# EAGLE design uv-dosimeter-guva-op-amp-mk-1.0 (EAGLE 7.5.0)
AUTHOR: sean@yak.net
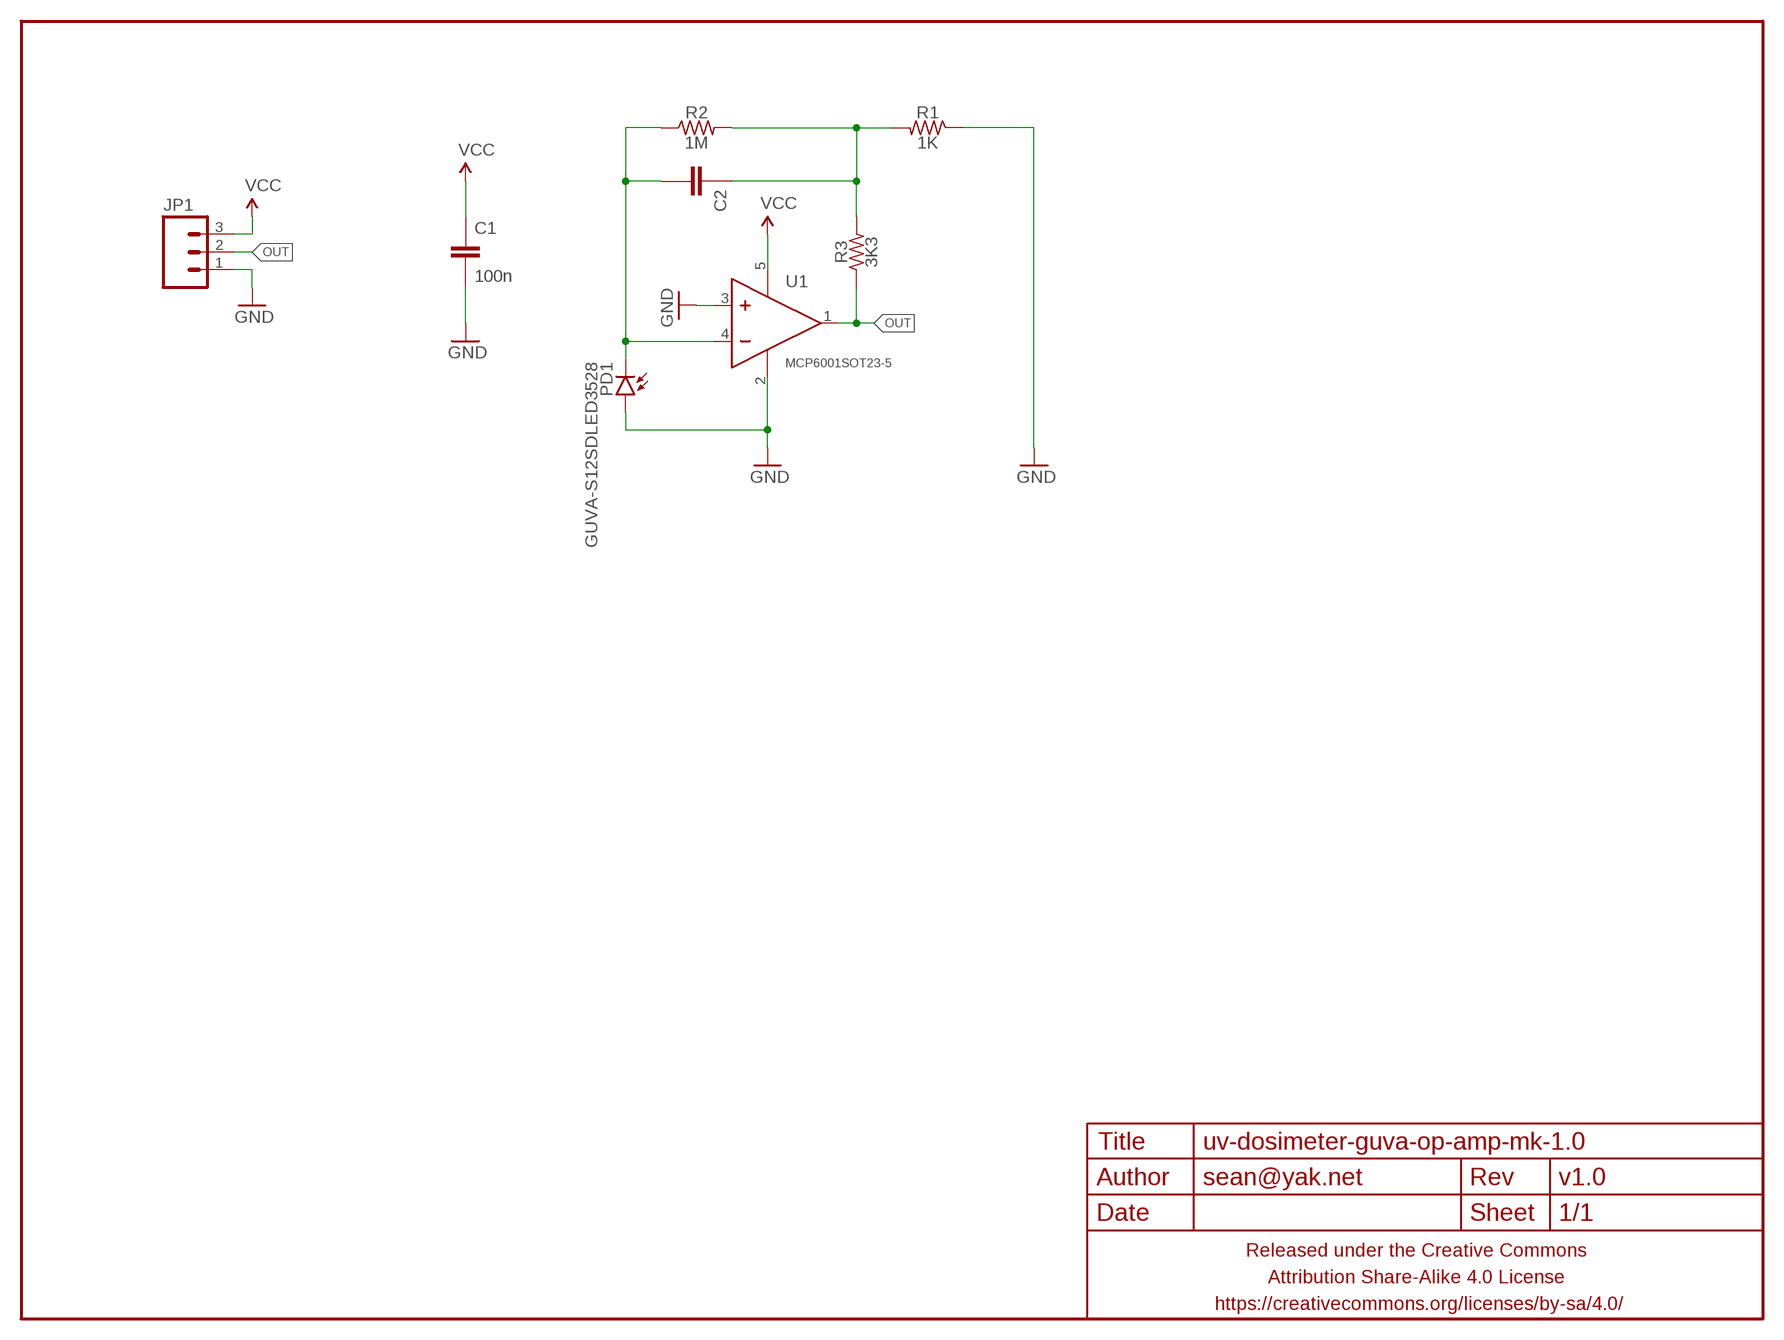
[diagram p0: schematic, sheet 1]

## Parts
C1  100n  CAPACITOR-CERAMICC0603  [C0603]
C2  CAPACITOR-CERAMICC0603  [C0603]
FRAME1  FRAME-LETTERNO_PACKAGE  [DUMMY]
JP1  M03PTH-CENTERED  [1X03-CENTERED]
PD1  GUVA-S12SDLED3528  [LED3528]
R1  1K  RESISTORR0603  [R0603]
R2  1M  RESISTORR0603  [R0603]
R3  3K3  RESISTORR0603  [R0603]
U1  MCP6001SOT23-5  [SOT23-5]

## Nets
GND: C1.2 JP1.1 PD1.A R1.1 U1.2(V-) U1.3(IN+)
N$2: C2.1 R1.2 R2.2 R3.2
N$3: C2.2 PD1.K(C) R2.1 U1.4(IN-)
OUT: JP1.2 R3.1 U1.1(OUT)
VCC: C1.1 JP1.3 U1.5(V+)

## Library data of the parts
C1 C2 = a_parts:CAPACITOR-CERAMIC: CAPACITOR, European symbol
FRAME1 = A_butts:FRAME-LETTER: Schematic Frame Standard 8.5x11 US Letter frame; DESIGNER: sean@yak.net; VERSION: v1.0
JP1 = a_parts:M03: Header 3 Standard 3-pin 0.1" header. Use with straight break away headers (SKU : PRT-00116), right angle break away headers (PRT-00553), swiss pins (PRT-00743), machine pins (PRT-00117), and female headers (PRT-00115). Molex polarized connector foot print use with SKU : PRT-08232 with associated crimp pins and housings.
PD1 = a_parts:GUVA-S12SD
R1-R3 = a_parts:RESISTOR: RESISTOR, American symbol
U1 = a_parts:MCP6001

## Board
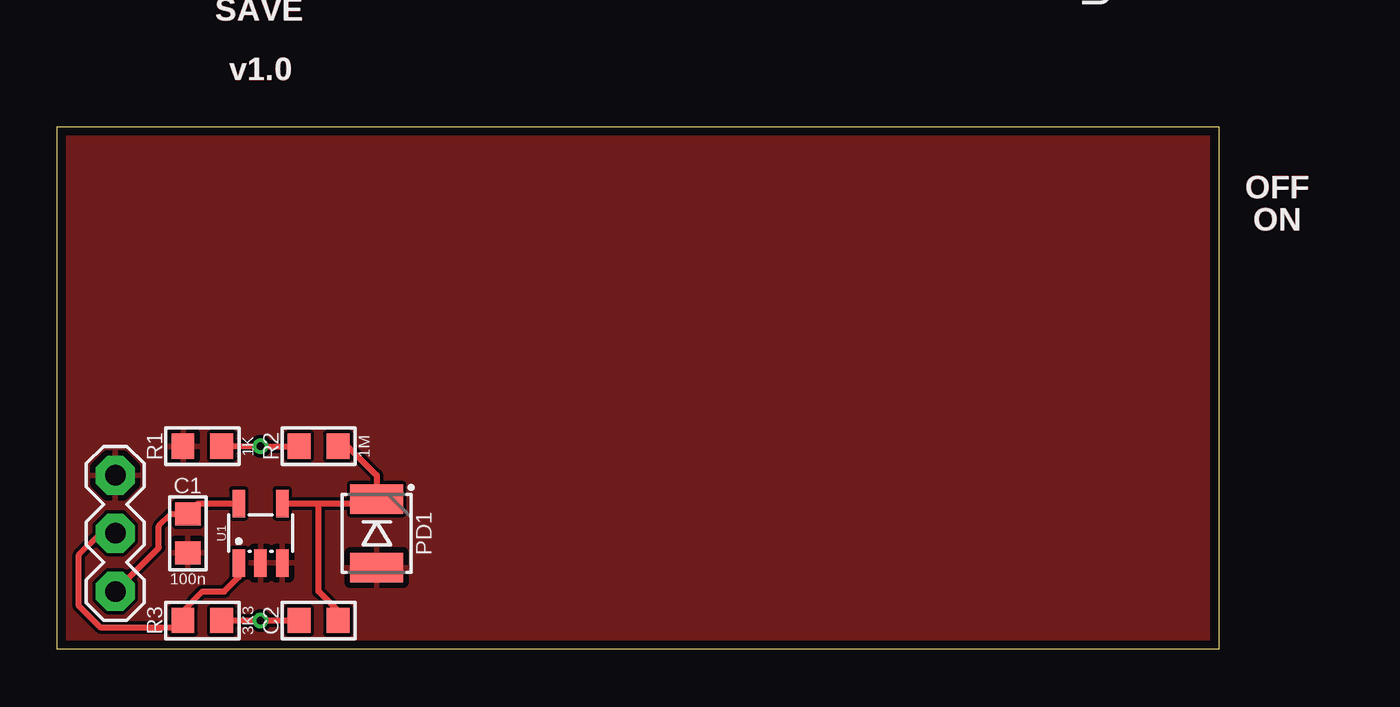
[diagram p1: board, top side]
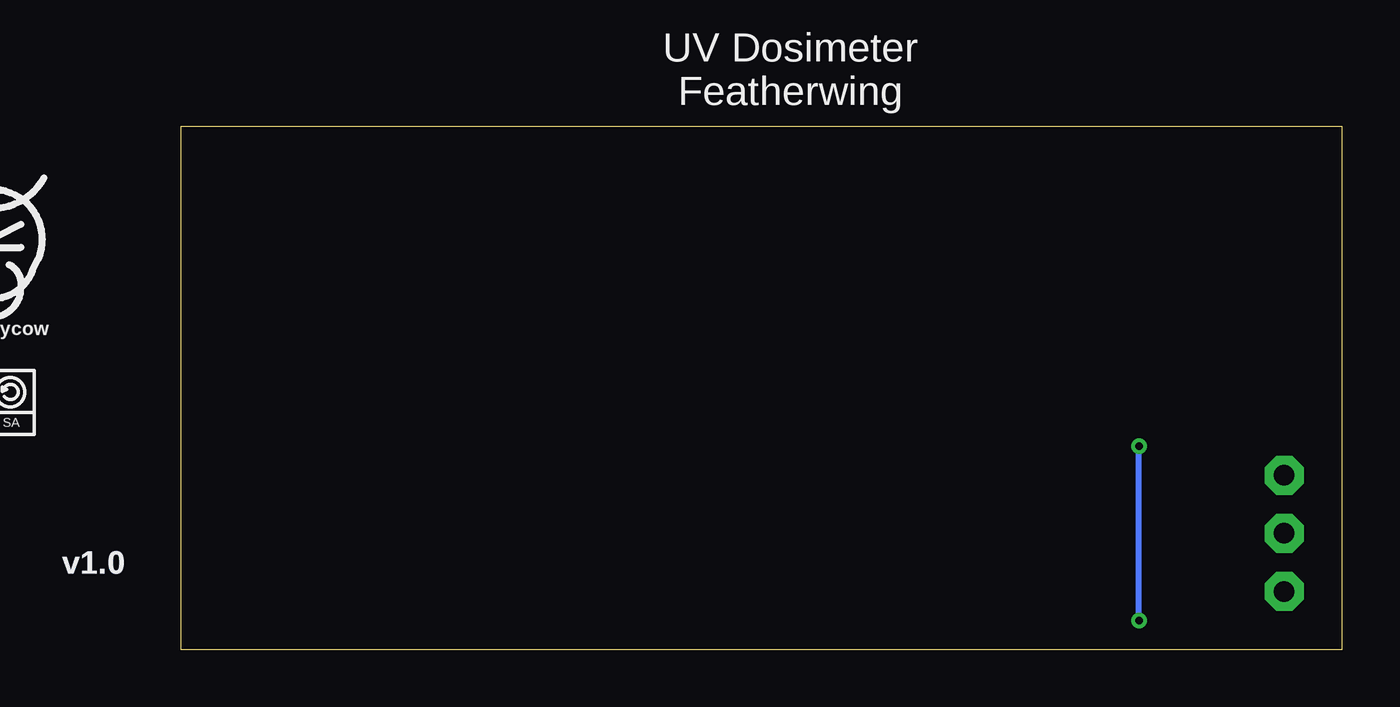
[diagram p2: board, bottom side, seen from below]

Size 50.8 x 22.86 mm. Coordinates in mm from the lower left corner, seen from the top.
Outline: 0,22.86 50.8,22.86 50.8,0 0,0 0,22.86
Copper layers (1*16): Top 0.0356mm / dielectric 1.5011mm / Bottom 0.0356mm
Design rules "LaenPCBOrder_2": minimum track width 6mil, minimum drill 13mil, track to track 6mil, track to pad 6mil, pad to pad 6mil, via to via 6mil, smd to smd 6mil, copper to edge 15mil, drill to drill 6mil, minimum pad ring 7mil, minimum via ring 7mil, stop-mask expansion 3mil, vias tented up to drill 20mil, thermal gap 10mil

### Footprints (pad centres in the part's own frame; a part is rotated, then mirrored left to right if it is on the bottom)
C0603 = smd 1 x 1.1: 1 -0.85,0; 2 0.85,0
1X03-CENTERED = drill 0.9 pad 1.7 octagon: 1 -2.54,0; 2 0,0; 3 2.54,0
LED3528 = smd 2.3 x 1.3: A 0,-1.5; K 0,1.5
R0603 = smd 1 x 1.1: 1 -0.85,0; 2 0.85,0
SOT23-5 = smd 0.55 x 1.2: 1 -0.95,-1.3; 2 0,-1.3; 3 0.95,-1.3; 4 0.95,1.3; 5 -0.95,1.3

### Placement (x,y rotation side)
C1  5.71,5.08 270 top
C2  11.43,1.27 0 top
FRAME1  0,0 90 bottom
JP1  2.54,5.08 270 top
PD1  13.97,5.08 0 top
R1  6.35,8.89 0 top
R2  11.43,8.89 180 top
R3  6.35,1.27 0 top
U1  8.89,5.08 0 top
U$1  [COW_SMALL]  59.05,18.1 0 bottom  (outside the outline)
U$5  [CC-BY-SA-4.0-NO-URL]  60.01,10.79 0 bottom  (outside the outline)

### Tracks (layer width: path | path; a pad name or v marks a point on that pad's centre or on a via)
GND
  pour Top (rank 6): 0,22.86 50.8,22.86 50.8,0 0,0
N$2  (via drill 0.33)
  Top 0.254: R1.2 v8.89,8.89 R2.2 | R3.2 v8.89,1.27 C2.1
  Bottom 0.254: v8.89,1.27 v8.89,8.89
N$3
  Top 0.254: U1.4 11.43,6.38 | 11.43,6.38 13.77,6.38 PD1.K 13.97,7.62 12.7,8.89 R2.1 | C2.2 12.28,1.69 11.43,2.54 11.43,6.38
OUT
  Top 0.254: JP1.2 1.91,5.08 0.95,4.13 0.95,1.91 1.91,0.95 5.18,0.95 R3.1 5.5,1.69 6.35,2.54 7.3,2.54 7.94,3.17 U1.1
VCC
  Top 0.254: JP1.3 4.45,4.45 4.45,5.4 4.98,5.93 C1.1 6.17,6.38 U1.5

### Text on the board
Top: SAVE | OFF | ON
tPlace: UV DOSIMETER | SAVE | OFF | ON
bPlace: UV Dosimeter / Featherwing | by schizobovine / <sean@yak.net>